# Altium project radxa_c200_io_board_v1.11.PrjPcb (part 5 of 8)

## Sheet 14_BUTTON_MCU.SchDoc: C200
size 594 x 420 mm; Page Create Date: March  8, 1995; Page Number: 14; Page Size: A2; Comment: radxa_1010; Page Count: 21; RevCode: V1.11; Doc: 14_BUTTON_MCU; DsnPath: D:\WMS\C200\CC122\对外\C200 V1.11.DSN; SchematicName: c200; PageName: 14_BUTTON_MCU; PageSize: A2; TopSchematic: True
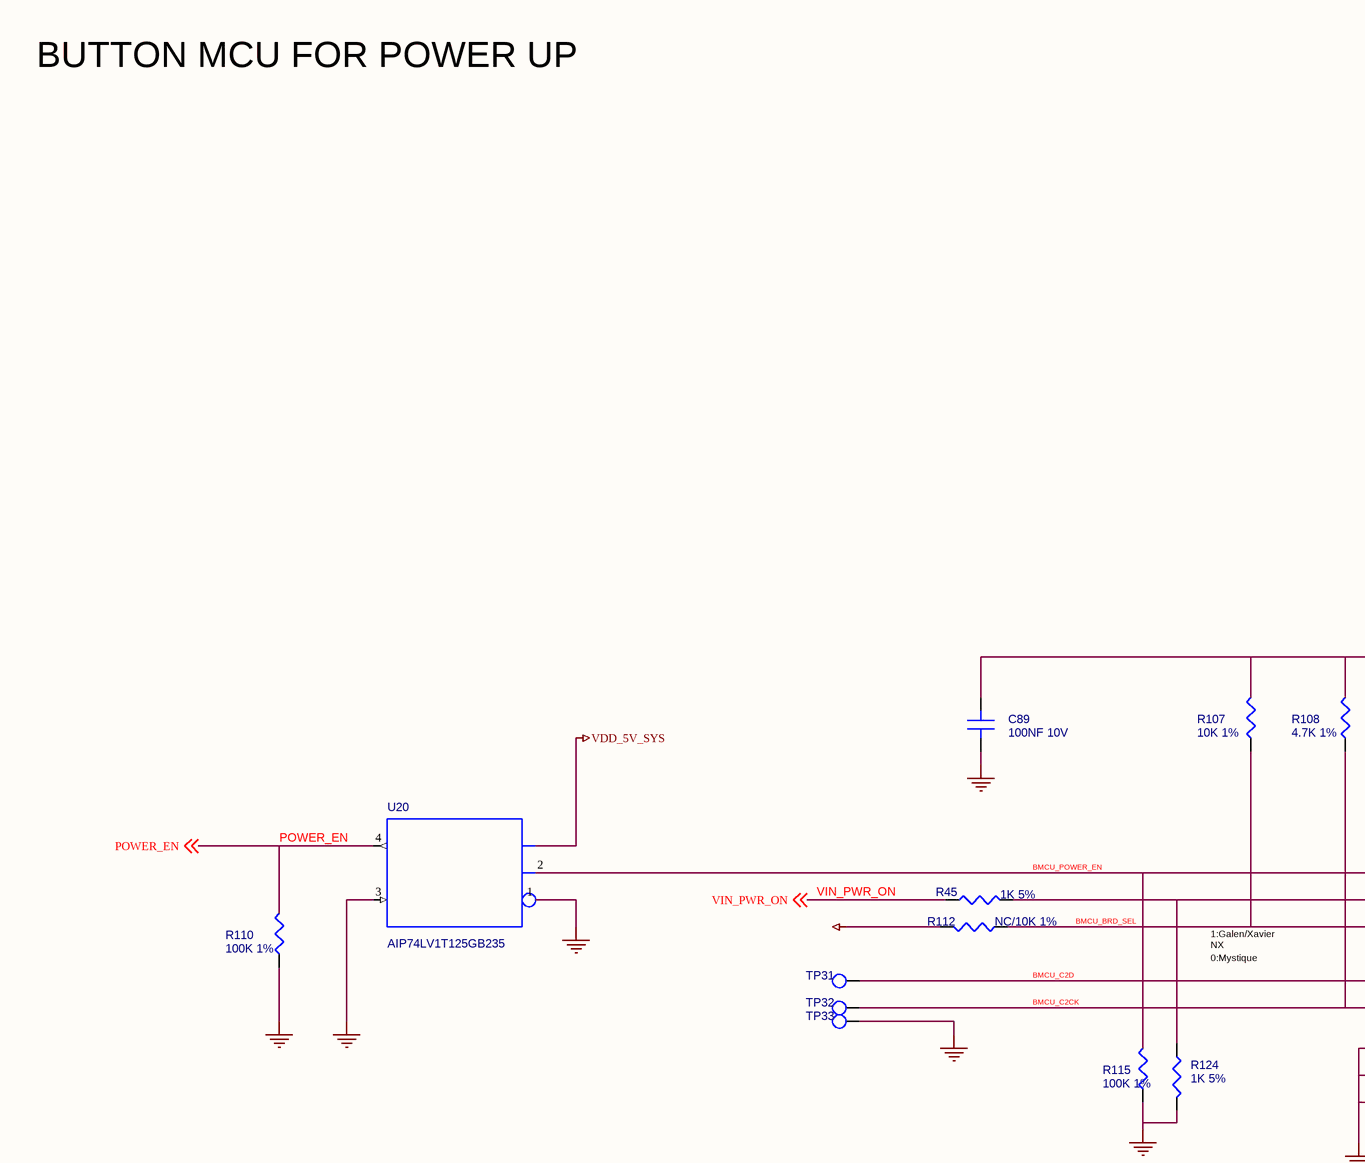
[diagram p26: 14_BUTTON_MCU.SchDoc, top left]
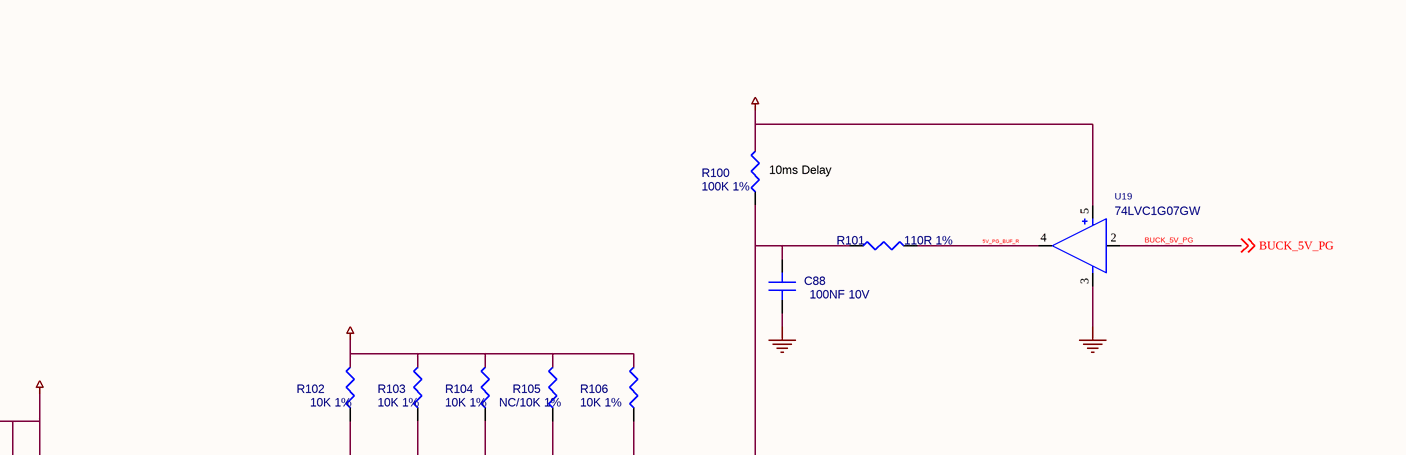
[diagram p27: 14_BUTTON_MCU.SchDoc, top right]
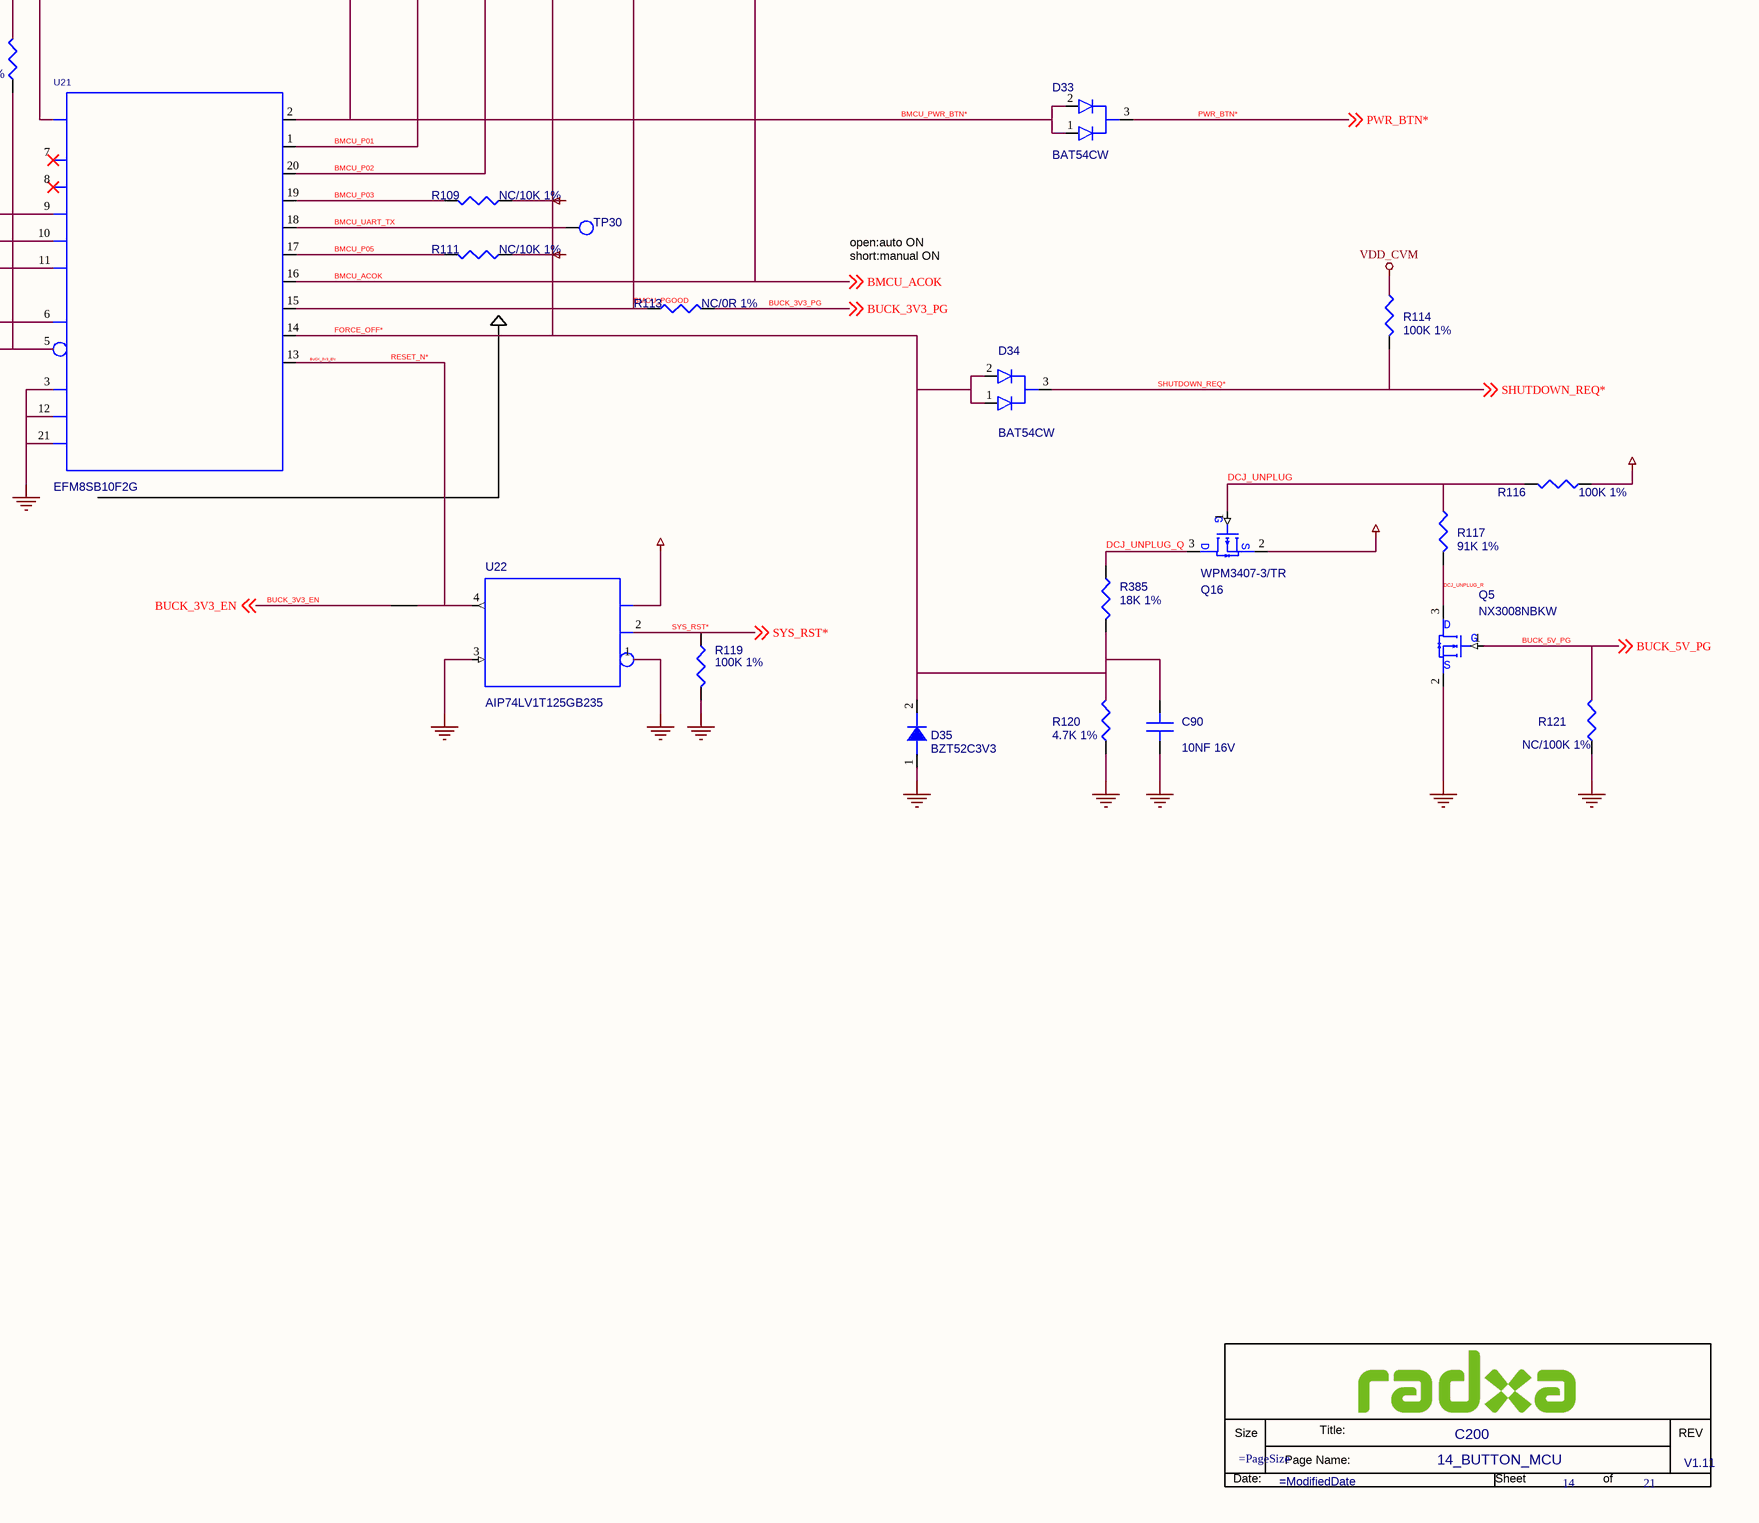
[diagram p28: 14_BUTTON_MCU.SchDoc, bottom right]

### Parts
(Parts that share a designator on the sheet are numbered #1, #2 ... from top to bottom, then left to right.)
*#13  Doc: 14_BUTTON_MCU  RevCode: V1.11  Title: C200  Page Number: 14  Page Count: 21  (hidden comment: radxa_1010)  (graphical)
C88  100NF 10V  [C0402]
C89  100NF 10V  [C0402]
C90  10NF 16V  [C0402]
D33  BAT54CW  [SOT323]
D34  BAT54CW  [SOT323]
D35  BZT52C3V3  [SOD_123]
Q5  NX3008NBKW  [SOT_323]
Q16  WPM3407-3/TR  [SOT_23]
R45  1K 5%  [R0402]
R100  100K 1%  [R0402]
R101  110R 1%  [R0402]
R102  10K 1%  [R0402]
R103  10K 1%  [R0402]
R104  10K 1%  [R0402]
R105  NC/10K 1%  [R0402]
R106  10K 1%  [R0402]
R107  10K 1%  [R0402]
R108  4.7K 1%  [R0402]
R109  NC/10K 1%  [R0402]
R110  100K 1%  [R0402]
R111  NC/10K 1%  [R0402]
R112  NC/10K 1%  [R0402]
R113  NC/0R 1%  [R0402]
R114  100K 1%  [R0402]
R115  100K 1%  [R0402]
R116  100K 1%  [R0402]
R117  91K 1%  [R0402]
R119  100K 1%  [R0402]
R120  4.7K 1%  [R0402]
R121  NC/100K 1%  [R0402]
R124  1K 5%  [R0402]
R385  18K 1%  [R0402]
TP30  DNI  [stp30]  (value not drawn)
TP31  DNI  [stp30]  (value not drawn)
TP32  DNI  [stp30]  (value not drawn)
TP33  DNI  [stp30]  (value not drawn)
U19  74LVC1G07GW  [SC70_5]
U20  AIP74LV1T125GB235  [SC70_5]
U21  EFM8SB10F2G  [QFN20_0D5_1D8]
U22  AIP74LV1T125GB235  [SC70_5]

### Nets
3V3_AO: C89.1(A) R100.1 R102.1 R103.1 R104.1 R105.1 R106.1 R107.1 R108.1 U19.5(VCC)
GND: C88.2(B) C89.2(B) C90.2(B) D35.1(A) Q5.2(S) R109.2 R110.2 R111.2 R112.1 R115.2 R119.2 R120.2 R121.2 R124.2 TP33.1 U19.3(GND) U20.1(OE*) U20.3(GND) U21.3(GND1) U21.12(GND2) U21.21(EPAD) U22.1(OE*) U22.3(GND)  [project net HUB2_SSTX_N_J25]
VCC: U20.5(VCC) U22.5(VCC)
VDD: U21.4(VDD)
VDD_CVM: R114.1
VDD_DCIN: Q16.2(S) R116.2
5V_PG_BUF_R: R101.2 U19.4(Y)
BMCU_ACOK: C88.1(A) R100.2 R101.1 U21.16(P0_6) ; off-sheet BMCU_ACOK
BMCU_BRD_SEL: R107.2 R112.2 U21.11(P1_2)
BMCU_C2CK: R108.2 TP32.1 U21.5(RST*)
BMCU_C2D: TP31.1 U21.6(P2_7_C2D)
BMCU_P01: R103.2 U21.1(P0_1)
BMCU_P02: R104.2 U21.20(P0_2)
BMCU_P03: R109.1 U21.19(P0_3)
BMCU_P05: R111.1 U21.17(P0_5)
BMCU_PGOOD: R106.2 R113.1 U21.15(P0_7)
BMCU_POWER_EN: R115.1 U20.2(IN) U21.9(P1_5)
BMCU_PWR_BTN*: D33.1(A1) D33.2(A2) R102.2 U21.2(P0_0)
BMCU_UART_TX: TP30.1 U21.18(P0_4)
BUCK_3V3_EN: U21.13(P1_1) U22.4(OUT) ; off-sheet BUCK_3V3_EN  [also labelled RESET_N*]
BUCK_3V3_PG: R113.2 ; off-sheet BUCK_3V3_PG
BUCK_5V_PG: Q5.1(G) R121.1 U19.2(A) ; off-sheet BUCK_5V_PG
DCJ_UNPLUG: Q16.1(G) R116.1 R117.1
DCJ_UNPLUG_Q: Q16.3(D) R385.1
DCJ_UNPLUG_R: Q5.3(D) R117.2
FORCE_OFF*: C90.1(A) D34.1(A1) D34.2(A2) D35.2(K) R105.2 R120.1 R385.2 U21.14(P1_0)
POWER_EN: R110.1 U20.4(OUT) ; off-sheet POWER_EN
PWR_BTN*: D33.3(CC) ; off-sheet PWR_BTN*  [project net AUTO_ON_DIS]
SHUTDOWN_REQ*: D34.3(CC) R114.2 ; off-sheet SHUTDOWN_REQ*
SYS_RST*: R119.1 U22.2(IN) ; off-sheet SYS_RST*
VIN_PWR_ON: R45.1 ; off-sheet VIN_PWR_ON
NetR45_2: R45.2 R124.1 U21.10(P1_3)

Not connected (* = marked no-connect by the designer): U21 7(P1_7)* 8(P1_6)*

### Notes on the sheet
- BUTTON MCU FOR POWER UP
- (near R100) 10ms Delay
- open:auto ON
- 1:Galen/Xavier
  NX
- 0:Mystique
- short:manual ON
- (in symbol radxa_1010) Title:; Size; REV; Page Name:; Date:; Sheet; of

### Library data of the parts
C88 = C: SMD  0402  100NF  10V  X5R  ±10%  ROHS; PARTS: 1; Part Reference: C88; Part Number: A1C01.00163; OriginalSymbolOrigin: (0,30); PKG_TYPE: CAP2-100-250; LEVEL: STD; PINSWAP: (A,B); Value: 100NF 10V; Part Type: 陶瓷电容; PCB Footprint: C0402
C89 = C: SMD  0402  100NF  10V  X5R  ±10%  ROHS; PARTS: 1; Part Reference: C89; Part Number: A1C01.00163; OriginalSymbolOrigin: (0,30); PKG_TYPE: CAP2-100-250; LEVEL: STD; PINSWAP: (A,B); Value: 100NF 10V; Part Type: 陶瓷电容; PCB Footprint: C0402
C90 = C: SMD  0402  10NF  16V  X7R  ±10%  ROHS; PARTS: 1; Part Reference: C90; Part Number: A1C01.00037; OriginalSymbolOrigin: (0,30); PKG_TYPE: CAP2-100-250; LEVEL: STD; PINSWAP: (A,B); Value: 10NF 16V; Part Type: 陶瓷电容; PCB Footprint: C0402
D33 = DIODE_S_3P: SMD  编带  SOT-323  BAT54CW  长电  ROHS; Part Reference: D33; Part Number: A1D02.00114; OriginalSymbolOrigin: (-50,100); PSPICETEMPLATE: X^@REFDES %a1 %a2 %cc @NV_PN; IMPLEMENTATION_TYPE: Pspice Model; PCB Footprint: SOT_323; SKU: COMMON; PLACEMENT_NOTE: ?; PATH: ?; PACK_TYPE: ?; NV_PN: ?; NV_NAME: ?; MAX_VOLTAGE: ?; MAX_CURRENT: ?; FORWARD_VOLTAGE: ?; CONTINUOUS_CURRENT: ?; CONFIGURATION: ?; ASSEMBLY: ?; Value: BAT54CW; Part Type: 二极管-ESD管-桥堆-TVS管
D34 = DIODE_S_3P: SMD  编带  SOT-323  BAT54CW  长电  ROHS; Part Reference: D34; Part Number: A1D02.00114; OriginalSymbolOrigin: (-50,100); PSPICETEMPLATE: X^@REFDES %a1 %a2 %cc @NV_PN; IMPLEMENTATION_TYPE: Pspice Model; PCB Footprint: SOT_323; SKU: COMMON; PLACEMENT_NOTE: ?; PATH: ?; PACK_TYPE: ?; NV_PN: ?; NV_NAME: ?; MAX_VOLTAGE: ?; MAX_CURRENT: ?; FORWARD_VOLTAGE: ?; CONTINUOUS_CURRENT: ?; CONFIGURATION: ?; ASSEMBLY: ?; Value: BAT54CW; Part Type: 二极管-ESD管-桥堆-TVS管
D35 = DIODE: SMD  编带  SOD-123  BZT52C3V3  ROHS; Part Reference: D35; Part Number: A1D02.00068; PCB Footprint: SOD_123; Value: BZT52C3V3; Part Type: 二极管-ESD管-桥堆-TVS管
Q5 = MOSFET_NPN: SMD  编带  SOT-323  NX3008NBKW  N沟道  Nexperia(安世)  ROHS; Part Reference: Q5; Part Number: A1D01.00070; Temp Coeff: -55℃ to ＋150℃; Value: NX3008NBKW; Part Type: 三极管-MOS管; PCB Footprint: SOT_323
Q16 = MOSFET_PNP: SMD  编带  SOT23-3  WPM3407-3/TR  P沟道  WILLSEMI(韦尔)  ROHS; Part Reference: Q16; Part Number: A1D01.00006; Temp Coeff: -55℃ to ＋150℃; Value: WPM3407-3/TR; Part Type: 三极管-MOS管; PCB Footprint: SOT_23
R45 = R: SMD  0201  1K  1/20W  ±5%  ROHS; Part Reference: R45; Part Number: A1R01.00018; PCB Footprint: R0201; Value: 1K 5%; Part Type: 贴片电阻
R100 = R: SMD  0402  100K  1/16W  ±1%  ROHS; Part Reference: R100; CDS_PHYS_PART_NAME: R_0402-100K,1 %,62.5MW,195-0005-000-100K,195-0005-000; CDS_PART_NAME: R_0402-100K,1 %,62.5MW,195-0005-000; Part Number: A1R01.00031; SEC: 1; XY: (-4200,6000); VER: 2; SIGNAL_MODEL: nv_res; PHYS_PAGE: 11; PATH: I5; PACK_TYPE: 402; NV_PN: 195-0005-000; MAX_WATTAGE: 62.5mW; DRAWING: #NAME?; DEVICE_TYPENAME: R_0402-100K1625MW195-0005-000-100K195-0005-000; CDS_LIB: discrete; ASSEMBLY: BUTTON_MCU; Temp Coeff: －55℃ ~ ＋155℃; PCB Footprint: R0402; Value: 100K 1%; TOL: 1%; ROT: 2; CHIPS_PART_NAME: R; CDS_SEC: 1; Part Type: 贴片电阻
R101 = R: SMD  0402  110R  1/16W  ±1%  ROHS; Part Reference: R101; Part Number: A1R01.00530; PCB Footprint: R0402; Value: 110R 1%; Part Type: 贴片电阻
R102 = R: SMD  0402  10K  1/16W  ±1%  ROHS; Part Reference: R102; CDS_PHYS_PART_NAME: R_0402-10K,1 %,62.5MW,195-0004-000-10K,195-0004-000; CDS_PART_NAME: R_0402-10K,1 %,62.5MW,195-0004-000; Part Number: A1R01.00222; SEC: 1; XY: (-5700,5200); VER: 2; SIGNAL_MODEL: nv_res; PHYS_PAGE: 11; PATH: I18; PACK_TYPE: 402; NV_PN: 195-0004-000; MAX_WATTAGE: 62.5mW; DRAWING: #NAME?; DEVICE_TYPENAME: R_0402-10K1625MW195-0004-000-10K195-0004-000; CDS_LIB: discrete; ASSEMBLY: BUTTON_MCU; PCB Footprint: R0402; Value: 10K 1%; TOL: 1%; ROT: 2; CHIPS_PART_NAME: R; CDS_SEC: 1; Part Type: 贴片电阻
R103 = R: SMD  0402  10K  1/16W  ±1%  ROHS; Part Reference: R103; CDS_PHYS_PART_NAME: R_0402-10K,1 %,62.5MW,195-0004-000-10K,195-0004-000; CDS_PART_NAME: R_0402-10K,1 %,62.5MW,195-0004-000; Part Number: A1R01.00222; SEC: 1; XY: (-5450,5200); VER: 2; SIGNAL_MODEL: nv_res; PHYS_PAGE: 11; PATH: I75; PACK_TYPE: 402; NV_PN: 195-0004-000; MAX_WATTAGE: 62.5mW; DRAWING: #NAME?; DEVICE_TYPENAME: R_0402-10K1625MW195-0004-000-10K195-0004-000; CDS_LIB: discrete; ASSEMBLY: BUTTON_MCU; PCB Footprint: R0402; Value: 10K 1%; TOL: 1%; ROT: 2; CHIPS_PART_NAME: R; CDS_SEC: 1; Part Type: 贴片电阻
R104 = R: SMD  0402  10K  1/16W  ±1%  ROHS; Part Reference: R104; CDS_PHYS_PART_NAME: R_0402-10K,1 %,62.5MW,195-0004-000-10K,195-0004-000; CDS_PART_NAME: R_0402-10K,1 %,62.5MW,195-0004-000; Part Number: A1R01.00222; SEC: 1; XY: (-5200,5200); VER: 2; SIGNAL_MODEL: nv_res; PHYS_PAGE: 11; PATH: I76; PACK_TYPE: 402; NV_PN: 195-0004-000; MAX_WATTAGE: 62.5mW; DRAWING: #NAME?; DEVICE_TYPENAME: R_0402-10K1625MW195-0004-000-10K195-0004-000; CDS_LIB: discrete; ASSEMBLY: BUTTON_MCU; PCB Footprint: R0402; Value: 10K 1%; TOL: 1%; ROT: 2; CHIPS_PART_NAME: R; CDS_SEC: 1; Part Type: 贴片电阻
R105 = R: SMD  0402  10K  1/16W  ±1%  ROHS; Part Reference: R105; CDS_PHYS_PART_NAME: R_0402-10K,1 %,62.5MW,195-0004-000-10K,195-0004-000; CDS_PART_NAME: R_0402-10K,1 %,62.5MW,195-0004-000; Part Number: A1R01.00222; SEC: 1; XY: (-4950,5200); VER: 2; SIGNAL_MODEL: nv_res; PHYS_PAGE: 11; PATH: I90; PACK_TYPE: 402; NV_PN: 195-0004-000; MAX_WATTAGE: 62.5mW; DRAWING: #NAME?; DEVICE_TYPENAME: R_0402-10K1625MW195-0004-000-10K195-0004-000; CDS_LIB: discrete; ASSEMBLY: BUTTON_MCU; PCB Footprint: R0402; Value: NC/10K 1%; TOL: 1%; SKU: NO STUFF; ROT: 2; CHIPS_PART_NAME: R; CDS_SEC: 1; Part Type: 贴片电阻
R106 = R: SMD  0402  10K  1/16W  ±1%  ROHS; Part Reference: R106; CDS_PHYS_PART_NAME: R_0402-10K,1 %,62.5MW,195-0004-000-10K,195-0004-000; CDS_PART_NAME: R_0402-10K,1 %,62.5MW,195-0004-000; Part Number: A1R01.00222; SEC: 1; XY: (-4650,5200); VER: 2; SIGNAL_MODEL: nv_res; PHYS_PAGE: 11; PATH: I101; PACK_TYPE: 402; NV_PN: 195-0004-000; MAX_WATTAGE: 62.5mW; DRAWING: #NAME?; DEVICE_TYPENAME: R_0402-10K1625MW195-0004-000-10K195-0004-000; CDS_LIB: discrete; ASSEMBLY: BUTTON_MCU; PCB Footprint: R0402; Value: 10K 1%; TOL: 1%; ROT: 2; CHIPS_PART_NAME: R; CDS_SEC: 1; Part Type: 贴片电阻
R107 = R: SMD  0402  10K  1/16W  ±1%  ROHS; Part Reference: R107; CDS_PHYS_PART_NAME: R_0402-10K,1 %,62.5MW,195-0004-000-10K,195-0004-000; CDS_PART_NAME: R_0402-10K,1 %,62.5MW,195-0004-000; Part Number: A1R01.00222; SEC: 1; XY: (-7300,4850); VER: 2; SIGNAL_MODEL: nv_res; PHYS_PAGE: 11; PATH: I24; PACK_TYPE: 402; NV_PN: 195-0004-000; MAX_WATTAGE: 62.5mW; DRAWING: #NAME?; DEVICE_TYPENAME: R_0402-10K1625MW195-0004-000-10K195-0004-000; CDS_LIB: discrete; ASSEMBLY: BUTTON_MCU; PCB Footprint: R0402; Value: 10K 1%; TOL: 1%; ROT: 2; CHIPS_PART_NAME: R; CDS_SEC: 1; Part Type: 贴片电阻
R108 = R: SMD  0402  4.7K  1/16W  ±1%  ROHS; Part Reference: R108; CDS_PHYS_PART_NAME: R_0402-4.7K,5 %,62.5MW,195-0598-000-195-0598-000,4.7K; CDS_PART_NAME: R_0402-4.7K,5 %,62.5MW,195-0598-000; Part Number: A1R01.00250; SEC: 1; XY: (-6950,4850); VER: 2; TOL: 5%; SIGNAL_MODEL: nv_res; PHYS_PAGE: 11; PATH: I21; PACK_TYPE: 402; NV_PN: 195-0598-000; MAX_WATTAGE: 62.5mW; DRAWING: #NAME?; DEVICE_TYPENAME: R_0402-47K5625MW195-0598-000-195-0598-00047K; CDS_LIB: discrete; ASSEMBLY: BUTTON_MCU; PCB Footprint: R0402; Value: 4.7K 1%; ROT: 2; CHIPS_PART_NAME: R; CDS_SEC: 1; Part Type: 贴片电阻
R109 = R: SMD  0402  10K  1/16W  ±1%  ROHS; Part Reference: R109; Part Number: A1R01.00222; PCB Footprint: R0402; Value: NC/10K 1%; Part Type: 贴片电阻
R110 = R: SMD  0402  100K  1/16W  ±1%  ROHS; Part Reference: R110; CDS_PHYS_PART_NAME: R_0402-100K,1 %,62.5MW,195-0005-000-100K,195-0005-000; CDS_PART_NAME: R_0402-100K,1 %,62.5MW,195-0005-000; Part Number: A1R01.00031; SEC: 1; XY: (-10900,4050); VER: 2; SIGNAL_MODEL: nv_res; PHYS_PAGE: 11; PATH: I66; PACK_TYPE: 402; NV_PN: 195-0005-000; MAX_WATTAGE: 62.5mW; DRAWING: #NAME?; DEVICE_TYPENAME: R_0402-100K1625MW195-0005-000-100K195-0005-000; CDS_LIB: discrete; ASSEMBLY: BUTTON_MCU; Temp Coeff: －55℃ ~ ＋155℃; PCB Footprint: R0402; Value: 100K 1%; TOL: 1%; ROT: 2; CHIPS_PART_NAME: R; CDS_SEC: 1; Part Type: 贴片电阻
R111 = R: SMD  0402  10K  1/16W  ±1%  ROHS; Part Reference: R111; Part Number: A1R01.00222; PCB Footprint: R0402; Value: NC/10K 1%; Part Type: 贴片电阻
R112 = R: SMD  0402  10K  1/16W  ±1%  ROHS; Part Reference: R112; Part Number: A1R01.00222; PCB Footprint: R0402; Value: NC/10K 1%; Part Type: 贴片电阻
R113 = R: SMD  0402  0R  1/16W  ±1%  ROHS; Part Reference: R113; Part Number: A1R01.00219; PCB Footprint: R0402; Value: NC/0R 1%; Part Type: 贴片电阻
R114 = R: SMD  0402  100K  1/16W  ±1%  ROHS; Part Reference: R114; CDS_PHYS_PART_NAME: R_0402-100K,1 %,62.5MW,195-0005-000-100K,195-0005-000; CDS_PART_NAME: R_0402-100K,1 %,62.5MW,195-0005-000; Part Number: A1R01.00031; SEC: 1; XY: (-1850,3900); VER: 2; ROT: 0; PHYS_PAGE: 11; PATH: I61; PACK_TYPE: 402; NV_PN: 195-0005-000; MAX_WATTAGE: 62.5mW; DRAWING: #NAME?; DEVICE_TYPENAME: R_0402-100K1625MW195-0005-000-100K195-0005-000; CDS_LIB: discrete; ASSEMBLY: BUTTON_MCU; Temp Coeff: －55℃ ~ ＋155℃; PCB Footprint: R0402; Value: 100K 1%; TOL: 1%; CHIPS_PART_NAME: R; CDS_SEC: 1; Part Type: 贴片电阻
R115 = R: SMD  0402  100K  1/16W  ±1%  ROHS; Part Reference: R115; CDS_PHYS_PART_NAME: R_0402-100K,1 %,62.5MW,195-0005-000-100K,195-0005-000; CDS_PART_NAME: R_0402-100K,1 %,62.5MW,195-0005-000; Part Number: A1R01.00031; SEC: 1; XY: (-7700,3550); VER: 2; SIGNAL_MODEL: nv_res; PHYS_PAGE: 11; PATH: I31; PACK_TYPE: 402; NV_PN: 195-0005-000; MAX_WATTAGE: 62.5mW; DRAWING: #NAME?; DEVICE_TYPENAME: R_0402-100K1625MW195-0005-000-100K195-0005-000; CDS_LIB: discrete; ASSEMBLY: BUTTON_MCU; Temp Coeff: －55℃ ~ ＋155℃; PCB Footprint: R0402; Value: 100K 1%; TOL: 1%; ROT: 2; CHIPS_PART_NAME: R; CDS_SEC: 1; Part Type: 贴片电阻
R116 = R: SMD  0402  100K  1/16W  ±1%  ROHS; Part Reference: R116; Part Number: A1R01.00031; Temp Coeff: －55℃ ~ ＋155℃; PCB Footprint: R0402; Value: 100K 1%; Part Type: 贴片电阻
R117 = R: SMD  0402  91K  1/16W  ±1%  ROHS; Part Reference: R117; Part Number: A1R01.00268; CDS_PART_NAME: R_0402-91K,5 %,62.5MW,195-0648-000; CDS_PHYS_PART_NAME: R_0402-91K,5 %,62.5MW,195-0648-000-195-0648-000,91K; ASSEMBLY: BUTTON_MCU; CDS_LIB: discrete; CDS_SEC: 1; DEVICE_TYPENAME: R_0402-91K5625MW195-0648-000-195-0648-00091K; DRAWING: #NAME?; MAX_WATTAGE: 62.5mW; NV_PN: 195-0648-000; PACK_TYPE: 402; PATH: I103; PHYS_PAGE: 11; ROT: 0; TOL: 5%; VER: 2; XY: (-1650,3100); PCB Footprint: R0402; Value: 91K 1%; Part Type: 贴片电阻; CHIPS_PART_NAME: R; SEC: 1
R119 = R: SMD  0402  100K  1/16W  ±1%  ROHS; Part Reference: R119; CDS_PHYS_PART_NAME: R_0402-100K,1 %,62.5MW,195-0005-000-100K,195-0005-000; CDS_PART_NAME: R_0402-100K,1 %,62.5MW,195-0005-000; Part Number: A1R01.00031; SEC: 1; XY: (-4400,2600); VER: 2; ROT: 0; PHYS_PAGE: 11; PATH: I94; PACK_TYPE: 402; NV_PN: 195-0005-000; MAX_WATTAGE: 62.5mW; DRAWING: #NAME?; DEVICE_TYPENAME: R_0402-100K1625MW195-0005-000-100K195-0005-000; CDS_LIB: discrete; ASSEMBLY: BUTTON_MCU; Temp Coeff: －55℃ ~ ＋155℃; PCB Footprint: R0402; Value: 100K 1%; TOL: 1%; CHIPS_PART_NAME: R; CDS_SEC: 1; Part Type: 贴片电阻
R120 = R: SMD  0402  4.7K  1/16W  ±1%  ROHS; Part Reference: R120; CDS_PHYS_PART_NAME: R_0402-5.11K,1 %,62.5MW,195-0004-000-10K,195-0344-000; CDS_PART_NAME: R_0402-5.11K,1 %,62.5MW,195-0344-000; Part Number: A1R01.00250; SEC: 1; XY: (-2900,2400); VER: 2; SIGNAL_MODEL: nv_res; PHYS_PAGE: 11; PATH: I77; PACK_TYPE: 402; NV_PN: 195-0344-000; MAX_WATTAGE: 62.5mW; DRAWING: #NAME?; DEVICE_TYPENAME: R_0402-10K1625MW195-0004-000-10K195-0004-000; CDS_LIB: discrete; ASSEMBLY: BUTTON_MCU; PCB Footprint: R0402; Value: 4.7K 1%; TOL: 1%; ROT: 2; CHIPS_PART_NAME: R; CDS_SEC: 1; Part Type: 贴片电阻
R121 = R: SMD  0402  100K  1/16W  ±1%  ROHS; Part Reference: R121; CDS_PHYS_PART_NAME: R_0402-100K,1 %,62.5MW,195-0005-000-100K,195-0005-000; CDS_PART_NAME: R_0402-100K,1 %,62.5MW,195-0005-000; Part Number: A1R01.00031; SEC: 1; XY: (-1100,2400); VER: 2; SIGNAL_MODEL: nv_res; PHYS_PAGE: 11; PATH: I87; PACK_TYPE: 402; NV_PN: 195-0005-000; MAX_WATTAGE: 62.5mW; DRAWING: #NAME?; DEVICE_TYPENAME: R_0402-100K1625MW195-0005-000-100K195-0005-000; CDS_LIB: discrete; ASSEMBLY: BUTTON_MCU; Temp Coeff: －55℃ ~ ＋155℃; PCB Footprint: R0402; Value: NC/100K 1%; TOL: 1%; ROT: 2; CHIPS_PART_NAME: R; CDS_SEC: 1; Part Type: 贴片电阻
R124 = R: SMD  0201  1K  1/20W  ±5%  ROHS; Part Reference: R124; Part Number: A1R01.00018; PCB Footprint: R0201; Value: 1K 5%; Part Type: 贴片电阻
R385 = R: SMD  0402  18K  1/16W  ±1%  ROHS; Part Reference: R385; Part Number: A1R01.00228; PCB Footprint: R0402; Value: 18K 1%; Part Type: 贴片电阻
TP30 = TP: Part Reference: TP30; MFRPN: NA; partnumber: NC_00025; Parameter: 测试点; PCB Footprint: TP32; Height: 0; MFRName: NA; partType: NC; Price: 0.00000
TP31 = TP: Part Reference: TP31; MFRPN: NA; partnumber: NC_00025; Parameter: 测试点; PCB Footprint: TP32; Height: 0; MFRName: NA; partType: NC; Price: 0.00000
TP32 = TP: MFRPN: NA; partnumber: NC_00025; Parameter: 测试点; PCB Footprint: TP32; Part Reference: TP32; Height: 0; MFRName: NA; partType: NC; Price: 0.00000
TP33 = TP: Part Reference: TP33; partnumber: NC_00025; MFRName: NA; Parameter: 测试点; PCB Footprint: TP32; Price: 0.00000; partType: NC; MFRPN: NA; Height: 0
U19 = 74LVC1G07GW: SMD  缓冲器  74LVC1G07GW  SOT-353  TECH PUBLIC(台舟)  ROHS; Part Reference: U19; Part Number: A1I01.00080; OriginalSymbolOrigin: (-100,100); NC: 1; SKU: COMMON; PLACEMENT_NOTE: ?; PATH: ?; PACK_TYPE: ?; NV_PN: ?; NV_NAME: ?; FUNCTION: ?; ASSEMBLY: ?; Value: 74LVC1G07GW; Part Type: 集成电路/模块; PCB Footprint: SC70_5
U20 = 74LVC1G125GW_125: SMD  缓冲器/驱动器  AIP74LV1T125GB235.TR  SOT23-5  I-CORE(中微爱芯)  ROHS; Part Reference: U20; Part Number: A1I01.01025; OriginalSymbolOrigin: (-300,200); Preferred: 优选; ASSEMBLY: ?; FUNCTION: ?; NV_NAME: ?; NV_PN: ?; PACK_TYPE: ?; PATH: ?; PLACEMENT_NOTE: ?; SKU: COMMON; Value: AIP74LV1T125GB235; Part Type: 集成电路/模块; PCB Footprint: SC70_5
U21 = EFM8SB10F2G: SMD  单片机51系列  EFM8SB10F2G-A-QFN20  2KB,RAM 256Byte  QFN20  SILICON LABS(芯科)  ROHS; Part Reference: U21; Part Number: A1I01.00765; OriginalSymbolOrigin: (-450,700); Temp Coeff: -40~85℃; TYPE: ?; SKU: COMMON; PLACEMENT_NOTE: ?; PATH: ?; PACK_TYPE: ?; NV_PN: ?; NV_NAME: ?; ASSEMBLY: ?; Value: EFM8SB10F2G; Part Type: 集成电路/模块; PCB Footprint: QFN20_0D5_1D8
U22 = 74LVC1G125GW_125: SMD  缓冲器/驱动器  AIP74LV1T125GB235.TR  SOT23-5  I-CORE(中微爱芯)  ROHS; Part Reference: U22; Part Number: A1I01.01025; OriginalSymbolOrigin: (-300,200); Preferred: 优选; ASSEMBLY: ?; FUNCTION: ?; NV_NAME: ?; NV_PN: ?; PACK_TYPE: ?; PATH: ?; PLACEMENT_NOTE: ?; SKU: COMMON; Value: AIP74LV1T125GB235; Part Type: 集成电路/模块; PCB Footprint: SC70_5
*#13 = radxa_1010: Page Create Date: March  8, 1995; Page Size: =PageSize; Page Modify Date: =ModifiedDate

## Sheet 15_Gigabit_Ethernet.SchDoc: C200
size 297 x 209 mm; Page Create Date: March  8, 1995; Page Number: 15; Page Size: A4; Comment: radxa_1010; Page Count: 21; RevCode: V1.11; Doc: 15_Gigabit_Ethernet; DsnPath: D:\WMS\C200\CC122\对外\C200 V1.11.DSN; SchematicName: c200; PageName: 15_Gigabit_Ethernet; PageSize: A4; TopSchematic: True
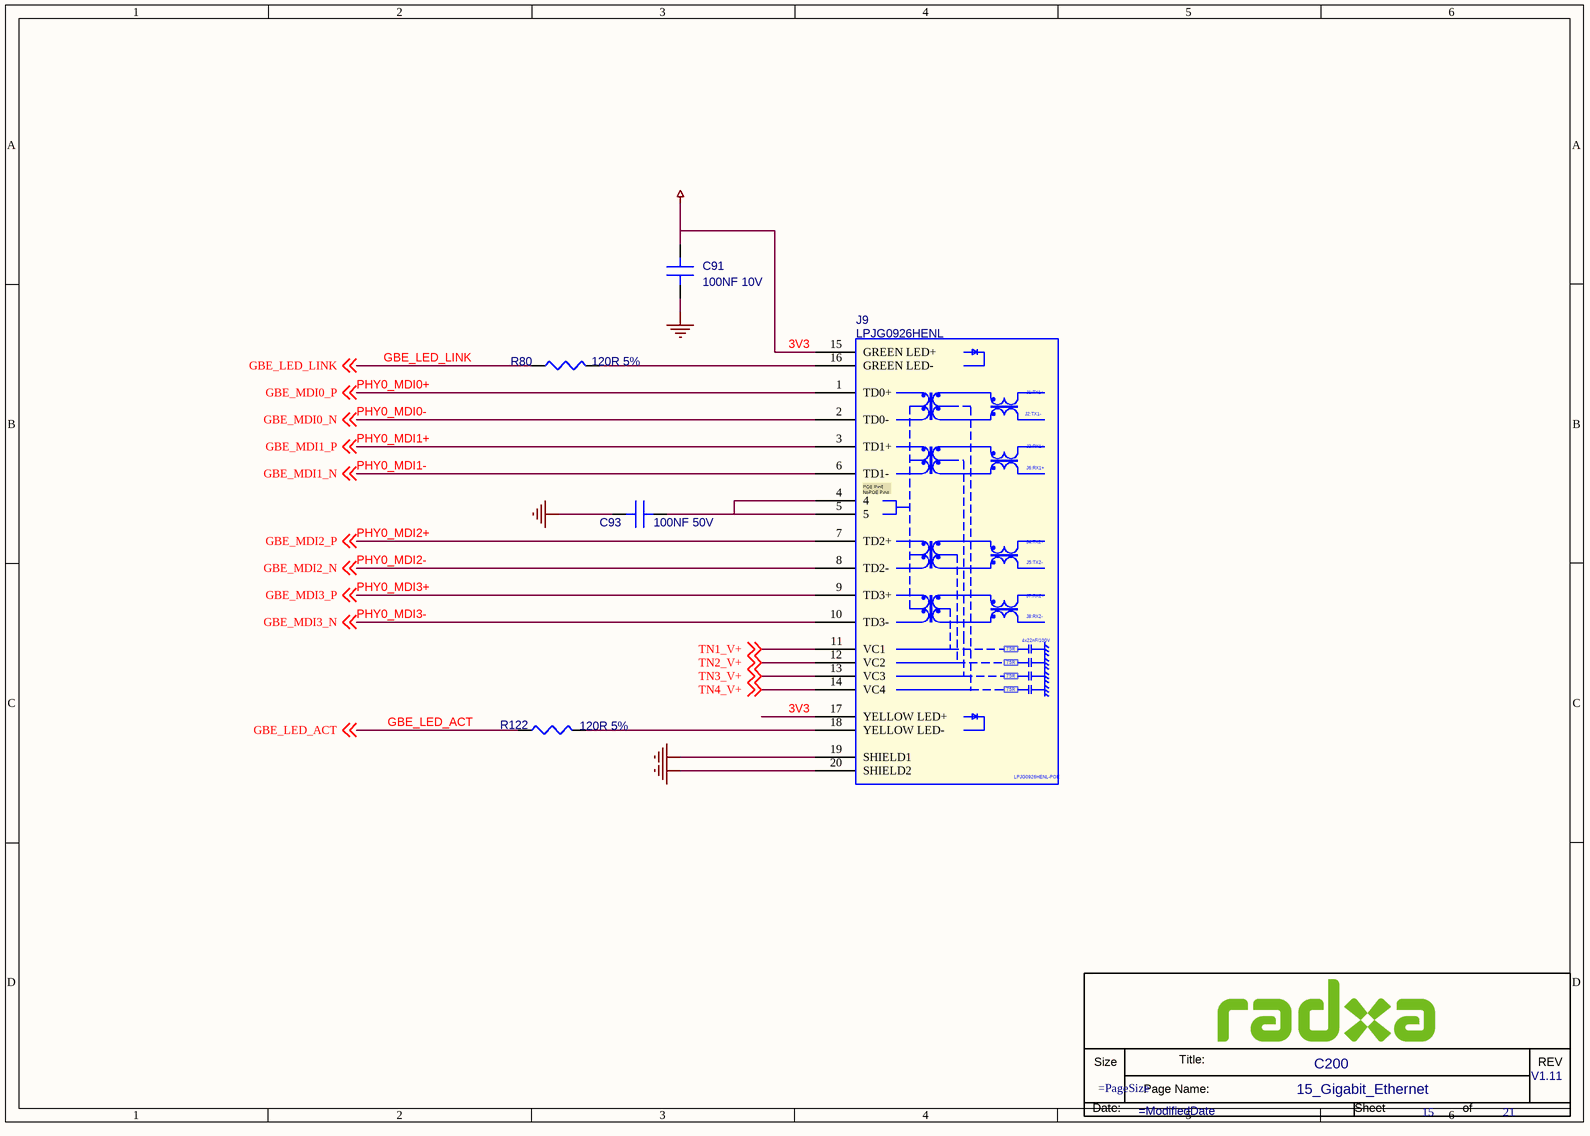
[diagram p29: 15_Gigabit_Ethernet.SchDoc]

### Parts
(Parts that share a designator on the sheet are numbered #1, #2 ... from top to bottom, then left to right.)
*#14  Doc: 15_Gigabit_Ethernet  RevCode: V1.11  Title: C200  Page Number: 15  Page Count: 21  (hidden comment: radxa_1010)  (graphical)
C91  100NF 10V  [C0201]
C93  100NF 50V  [C0201]
J9  LPJG0926HENL  [RJ45_LED_TH22_LIE]
R80  120R 5%  [R0402]
R122  120R 5%  [R0402]

### Nets
3V3: C91.2(B) J9.15(GREEN_LED+) J9.17(YELLOW_LED+)  [also labelled VDD_3V3_SYS]
GND: C91.1(A) C93.1(A) J9.19(SHIELD1) J9.20(SHIELD2)  [project net HUB2_SSTX_N_J25]
GBE_LED_ACT: R122.1 ; off-sheet GBE_LED_ACT
GBE_LED_LINK: R80.1 ; off-sheet GBE_LED_LINK
GBE_MDI0_N: J9.2(TD0-) ; off-sheet GBE_MDI0_N  [also labelled PHY0_MDI0-]
GBE_MDI0_P: J9.1(TD0+) ; off-sheet GBE_MDI0_P  [also labelled PHY0_MDI0+]
GBE_MDI1_N: J9.6(TD1-) ; off-sheet GBE_MDI1_N  [also labelled PHY0_MDI1-]
GBE_MDI1_P: J9.3(TD1+) ; off-sheet GBE_MDI1_P  [also labelled PHY0_MDI1+]
GBE_MDI2_N: J9.8(TD2-) ; off-sheet GBE_MDI2_N  [also labelled PHY0_MDI2-]
GBE_MDI2_P: J9.7(TD2+) ; off-sheet GBE_MDI2_P  [also labelled PHY0_MDI2+]
GBE_MDI3_N: J9.10(TD3-) ; off-sheet GBE_MDI3_N  [also labelled PHY0_MDI3-]
GBE_MDI3_P: J9.9(TD3+) ; off-sheet GBE_MDI3_P  [also labelled PHY0_MDI3+]
TN1_V+: J9.11(VC1) ; off-sheet TN1_V+
TN2_V+: J9.12(VC2) ; off-sheet TN2_V+
TN3_V+: J9.13(VC3) ; off-sheet TN3_V+
TN4_V+: J9.14(VC4) ; off-sheet TN4_V+
NetC93_2: C93.2(B) J9.4 J9.5
NetJ9_16: J9.16(GREEN_LED-) R80.2
NetJ9_18: J9.18(YELLOW_LED-) R122.2

### Notes on the sheet
- (in symbol LPJG0926HENL) J1:TX1+; J2:TX1-; J3:RX1+; J6:RX1+; POE:Pin6 / NoPOE:Pin4; J4:TX2+; J5:TX2-; J7:RX2+; J8:RX2-; 4x22nF/100V; 75R; LPJG0926HENL-POE
- (in symbol radxa_1010) Size; Title:; REV; Page Name:; Date:; Sheet; of

### Library data of the parts
C91 = C: SMD  0201  100NF  10V  X5R  ±20%  ROHS; PARTS: 1; Part Reference: C91; Part Number: A1C01.00009; OriginalSymbolOrigin: (0,30); PKG_TYPE: CAP2-100-250; LEVEL: STD; PINSWAP: (A,B); Value: 100NF 10V; Part Type: 陶瓷电容; PCB Footprint: C0201
C93 = C: SMD  0201  100NF  50V  NPO  ±10%  ROHS; PARTS: 1; Part Reference: C93; Part Number: A1C01.00279; OriginalSymbolOrigin: (0,30); PKG_TYPE: CAP2-100-250; LEVEL: STD; PINSWAP: (A,B); Value: 100NF 50V; Part Type: 陶瓷电容; PCB Footprint: C0201
J9 = LPJG0926HENL: DIP  母座  千兆网  带POE功能  18PIN  21.5*16*13.7MM  LPJG0926HENL  镀镍  带指示灯  无弹片  左绿右黄  LP  ROHS; Part Reference: J9; Part Number: A1J03.00002; Parameter: 连接器-带POE功能的集成变压器RJ45; Value: LPJG0926HENL; Part Type: RJ45座; PCB Footprint: RJ45_LED_TH22_LIE
R80 = R: SMD  0201  120R  1/20W  ±5%  ROHS; Part Reference: R80; Part Number: A1R01.00091; PCB Footprint: R0201; Value: 120R 5%; Part Type: 贴片电阻
R122 = R: SMD  0201  120R  1/20W  ±5%  ROHS; Part Reference: R122; Part Number: A1R01.00091; PCB Footprint: R0201; Value: 120R 5%; Part Type: 贴片电阻
*#14 = radxa_1010: Page Create Date: March  8, 1995; Page Size: =PageSize; Page Modify Date: =ModifiedDate